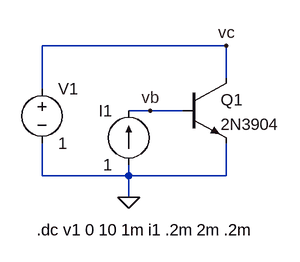
[diagram p0: schematic Draft1.asc]
Draft1.asc, the LTspice schematic file:
Version 4
SHEET 1 880 680
WIRE 528 176 256 176
WIRE 528 224 528 176
WIRE 256 240 256 176
WIRE 416 272 384 272
WIRE 464 272 416 272
WIRE 256 368 256 320
WIRE 384 368 384 352
WIRE 384 368 256 368
WIRE 528 368 528 320
WIRE 528 368 384 368
WIRE 384 400 384 368
FLAG 384 400 0
FLAG 528 176 vc
FLAG 416 272 vb
SYMBOL npn 464 224 R0
SYMATTR InstName Q1
SYMATTR Value 2N3904
SYMBOL current 384 352 R180
WINDOW 0 24 80 Left 2
WINDOW 3 24 0 Left 2
SYMATTR InstName I1
SYMATTR Value 1
SYMBOL Voltage 256 224 R0
SYMATTR InstName V1
SYMATTR Value 1
TEXT 248 448 Left 2 !.dc v1 0 10 1m i1 .2m 2m .2m

The netlist it stands for:
* Draft1.asc
Q1 vc vb 0 0 2N3904
I1 0 vb 1
V1 vc 0 1
.model NPN NPN
.model PNP PNP
.lib standard.bjt
.dc v1 0 10 1m i1 .2m 2m .2m
.backanno
.end